# EAGLE design chrono (EAGLE 5.11)
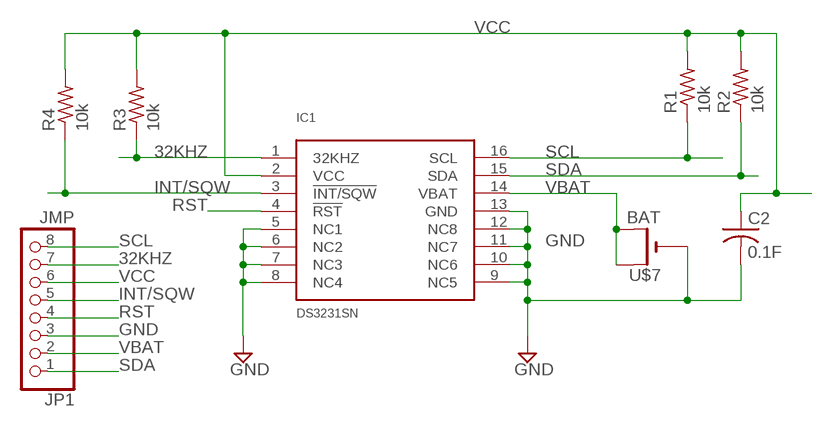
[diagram p0: schematic, sheet 1]

## Parts
C2  0.1F  C-USC1206  [C1206]
IC1  DS3231SN  [SO16W]
JP1  JMP  PINHD-1X8/90  [1X08/90]
R1  10k  R-US_R1206  [R1206]
R2  10k  R-US_R1206  [R1206]
R3  10k  R-US_R1206  [R1206]
R4  10k  R-US_R1206  [R1206]
U$7  BAT  CR1220SMT  [CR1220-SMD]

## Nets
32KHZ: IC1.1(32KHZ) JP1.7 R3.1
GND: C2.2 IC1.5(NC1) IC1.6(NC2) IC1.7(NC3) IC1.8(NC4) IC1.9(NC5) IC1.10(NC6) IC1.11(NC7) IC1.12(NC8) IC1.13(GND) JP1.3 U$7.-
INT/SQW: IC1.3(!INT/SQW) JP1.5 R4.1
RST: IC1.4(!RST) JP1.4
SCL: IC1.16(SCL) JP1.8 R1.1
SDA: IC1.15(SDA) JP1.1 R2.1
VBAT: IC1.14(VBAT) JP1.2 U$7.+$1(+) U$7.+$2(+1)
VCC: C2.1 IC1.2(VCC) JP1.6 R1.2 R2.2 R3.2 R4.2

## Library data of the parts
C2 = resistor:C-US: CAPACITOR, American symbol
IC1 = comfile:DS3231SN
JP1 = pinhead:PINHD-1X8: PIN HEADER
R1-R4 = resistor:R-US_: RESISTOR, American symbol
U$7 = adafruit:CR1220: CR1216/CR1220/CR1225 12mm 3V lithium coin cell Great for battery packup. Both SMT and THM holders. Note the THM package has the ground pads on both sides of the PCB so that the masks are the same - this reduces the cost

## Board
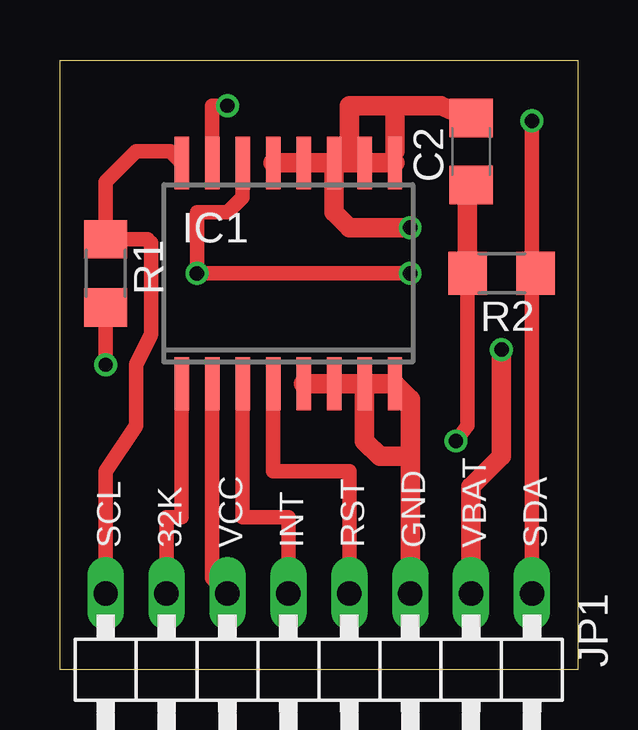
[diagram p1: board, top side]
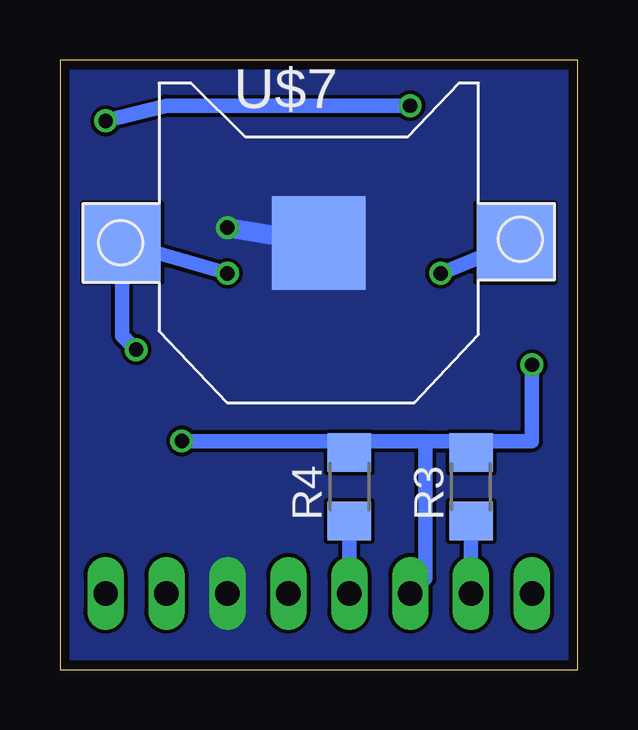
[diagram p2: board, bottom side, seen from below]

Size 21.59 x 25.4 mm. Coordinates in mm from the lower left corner, seen from the top.
Outline: 0,0 0,25.4 21.59,25.4 21.59,0 0,0
Copper layers (1*16): Top 0.0356mm / dielectric 1.5011mm / Bottom 0.0356mm
Design rules "LaenPCBOrder": minimum track width 6mil, minimum drill 13mil, track to track 6mil, track to pad 6mil, pad to pad 6mil, via to via 6mil, smd to smd 6mil, copper to edge 15mil, drill to drill 6mil, minimum pad ring 7mil, minimum via ring 7mil, stop-mask expansion 4mil, vias tented up to drill 0mil, thermal gap 10mil

### Footprints (pad centres in the part's own frame; a part is rotated, then mirrored left to right if it is on the bottom)
C1206 = smd 1.6 x 1.8: 1 -1.4,0; 2 1.4,0
SO16W = smd 0.6 x 2.2: 1 -4.445,-4.6; 2 -3.175,-4.6; 3 -1.905,-4.6; 4 -0.635,-4.6; 5 0.635,-4.6; 6 1.905,-4.6; 7 3.175,-4.6; 8 4.445,-4.6; 9 4.445,4.6; 10 3.175,4.6; 11 1.905,4.6; 12 0.635,4.6; 13 -0.635,4.6; 14 -1.905,4.6; 15 -3.175,4.6; 16 -4.445,4.6
1X08/90 = drill 1.016 long: 1 -8.89,-3.81; 2 -6.35,-3.81; 3 -3.81,-3.81; 4 -1.27,-3.81; 5 1.27,-3.81; 6 3.81,-3.81; 7 6.35,-3.81; 8 8.89,-3.81
R1206 = smd 1.6 x 1.803: 1 -1.422,0; 2 1.422,0
CR1220-SMD = smd 3.2 x 3.2: +$1 -8.2,0; +$2 8.2,0 | smd 3.9 x 3.9: - 0,0

### Placement (x,y rotation side)
C2  17.14,21.59 90 top
IC1  9.53,16.51 0 top
JP1  10.79,-0.64 180 top
R1  1.91,16.51 270 top
R2  18.41,16.51 180 top
R3  4.45,7.62 90 bottom
R4  9.53,7.62 90 bottom
U$7  10.79,17.78 0 bottom

### Tracks (layer width: path | path; a pad name or v marks a point on that pad's centre or on a via)
32KHZ
  Top 0.61: IC1.1 5.08,6.35 4.45,6.35 JP1.7
  Bottom 0.61: JP1.7 R3.1
GND  (via drill 0.6)
  Top 0.813: IC1.13 IC1.12 IC1.11 | IC1.11 12.06,21.11 | 12.06,21.11 IC1.10 IC1.9 | IC1.5 IC1.6 IC1.7 | IC1.7 IC1.8 14.61,11.28 14.61,8.89 | JP1.3 14.61,8.89 | IC1.7 12.7,9.53 13.34,8.89 14.61,8.89 | 12.06,21.11 12.06,23.5 13.97,23.5 | C2.2 17.02,22.99 15.88,23.5 13.97,23.5 | 13.97,23.5 13.97,21.59 | IC1.11 11.43,19.05 12.06,18.41 v14.61,18.41
  Bottom 0.813: U$7.- v14.61,18.41
  pour Bottom (no thermals): 0,25.4 21.59,25.4 21.59,0 0,0
INT/SQW
  Top 0.61: JP1.5 9.53,6.35 7.62,6.35 IC1.3
  Bottom 0.61: JP1.5 R4.1
RST
  Top 0.61: IC1.4 8.89,8.26 12.06,8.26 JP1.4
SCL
  Top 0.254: 3.81,17.78 3.66,17.93
  Top 0.61: IC1.16 4.6,21.59 3.17,21.59 1.91,20.32 R1.1 3.66,17.93 | 3.81,17.78 3.81,13.97 3.17,12.7 3.17,10.16 1.91,8.26 JP1.8
SDA  (via drill 0.6)
  Top 0.254: IC1.15 6.2,21.11
  Top 0.406: 19.68,16.36 R2.1
  Top 0.61: IC1.15 6.35,23.5 v6.99,23.5 | v19.68,22.86 19.68,16.36 JP1.1
  Bottom 0.61: v6.99,23.5 17.14,23.5 v19.68,22.86
VBAT  (via drill 0.6)
  Top 0.61: v14.61,16.51 v5.71,16.51 5.71,19.05 6.99,19.05 7.62,19.68 IC1.14
  Top 0.813: v18.41,13.34 18.41,8.89 17.14,7.62 JP1.2
  Bottom 0.61: v5.71,16.51 U$7.+$2 | v14.61,16.51 U$7.+$1 19,13.91 v18.41,13.34
VCC  (via drill 0.6)
  Top 0.61: v16.51,9.53 16.99,10.16 R2.2 | v1.91,12.7 R1.2 | IC1.2 6.35,3.81 JP1.6
  Top 0.813: R2.2 16.99,20.04 C2.1
  Bottom 0.61: 4.45,9.53 1.91,9.53 v1.91,12.7 | 6.35,9.53 4.45,9.53 | 6.35,9.53 9.53,9.53 | 9.53,9.53 v16.51,9.53 | 4.45,9.53 R3.2 | 9.53,9.53 R4.2 | 6.35,9.53 6.35,3.81 JP1.6

### Text on the board
tPlace: SCL | 32K | VCC | INT | RST | GND | VBAT | SDA